# EAGLE schematic raspi (EAGLE 9.2.2)
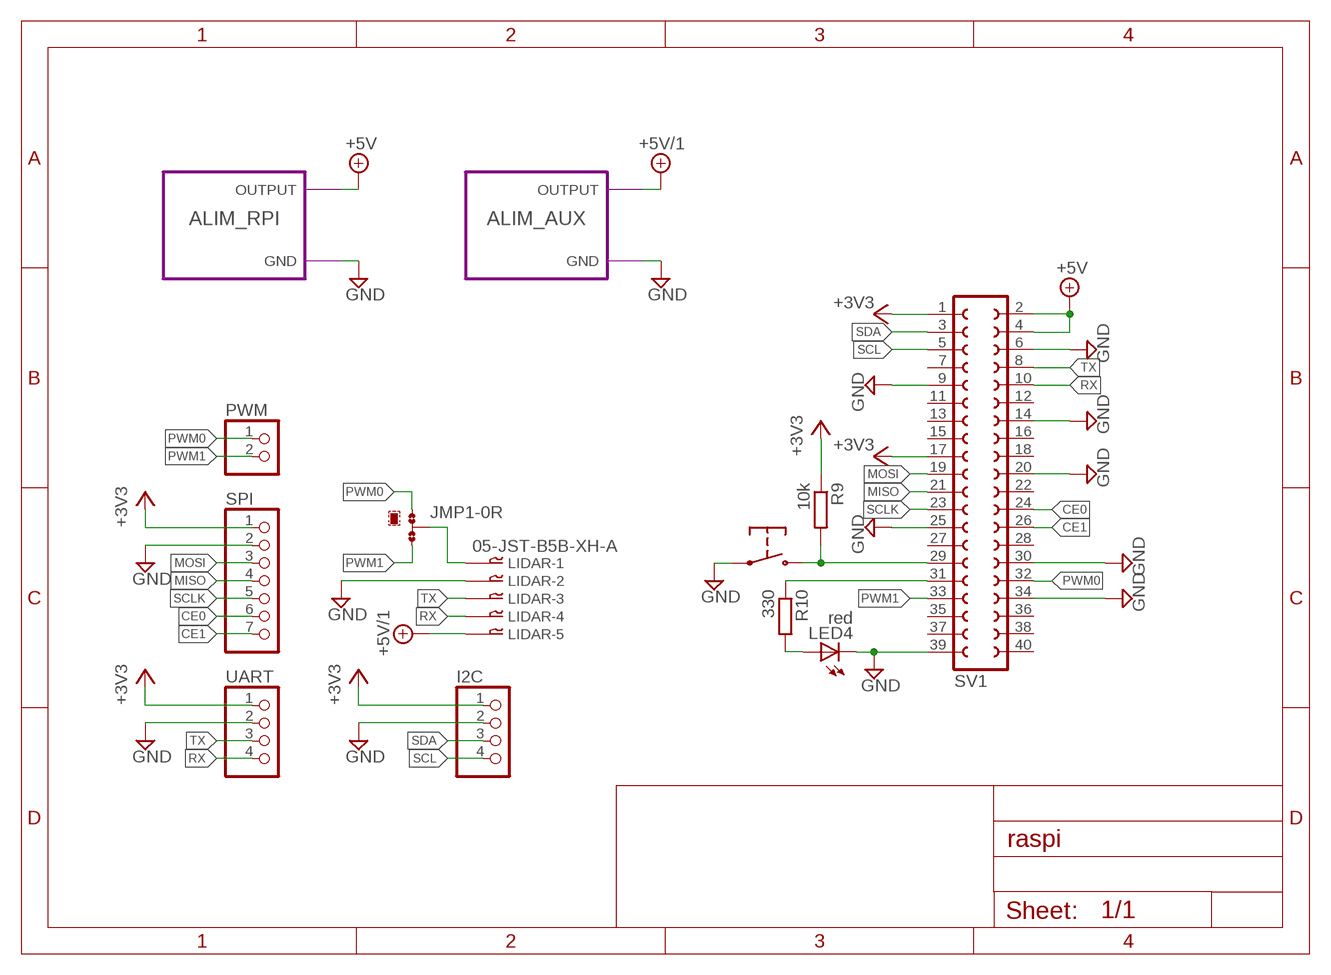
[diagram p0: schematic, sheet 1]

## Parts
I2C  PINHD-1X4  [1X04]
JMP1  0R-JUMPA  [A0R-JMP]
LED4  red  LEDSMT1206  [1206]
LIDAR  05-JST-B5B-XH-A  [B5B-XH]
PWM  PINHD-1X2  [1X02]
R9  10k  R-EU_R0805  [R0805]
R10  330  R-EU_R0805  [R0805]
SPI  PINHD-1X7  [1X07]
SV1  FE20-2  [FE20-2]
U$2  PUSH-BUTTON  [PUSH-BUTTON]
UART  PINHD-1X4  [1X04]

## Module instances
ALIM_RPI = 5V_ALIM
ALIM_AUX = 5V_ALIM

## Nets
+3V3: I2C.1 R9.1 SPI.1 SV1.1 SV1.17 UART.1
+5V [2A]: SV1.2 SV1.4 ; port ALIM_RPI.OUTPUT
+5V/1: LIDAR.P$5 ; port ALIM_AUX.OUTPUT
CE0: SPI.6 SV1.24
CE1: SPI.7 SV1.26
GND: I2C.2 LED4.C LIDAR.P$2 SPI.2 SV1.6 SV1.9 SV1.14 SV1.20 SV1.25 SV1.30 SV1.34 SV1.39 U$2.1 U$2.2 UART.2 ; port ALIM_RPI.GND ALIM_AUX.GND
MISO: SPI.4 SV1.21
MOSI: SPI.3 SV1.19
N$1: JMP1.2 LIDAR.P$1
N$2: R9.2 SV1.29 U$2.3 U$2.4
N$5: R10.1 SV1.31
N$11: LED4.A R10.2
PWM0: JMP1.1 PWM.1 SV1.32
PWM1: JMP1.3 PWM.2 SV1.33
RX: LIDAR.P$4 SV1.10 UART.4
SCL: I2C.4 SV1.5
SCLK: SPI.5 SV1.23
SDA: I2C.3 SV1.3
TX: LIDAR.P$3 SV1.8 UART.3
Unconnected: SV1.7 SV1.11 SV1.12 SV1.13 SV1.15 SV1.16 SV1.18 SV1.22 SV1.27 SV1.28 SV1.35 SV1.36 SV1.37 SV1.38 SV1.40

## Library data of the parts
I2C UART = pinhead:PINHD-1X4: PIN HEADER
JMP1 = jump-0r-smd:0R-JUMP: SMD 0R 0805 Jumper
LED4 = led:LED: LED OSRAM: - CHIPLED LG R971, LG N971, LY N971, LG Q971, LY Q971, LO R971, LY R971 LH N974, LH R974 LS Q976, LO Q976, LY Q976 LO Q996 - Hyper CHIPLED LW Q18S LB Q993, LB Q99A, LB R99A - SideLED LS A670, LO A670, LY A670, LG A670, LP A670 LB A673, LV A673, LT A673, LW A673 LH A674 LY A675 LS A676, LA A676, LO A676, LY A676, LW A676 LS A679, LY A679, LG A679 - Hyper Micro SIDELED® LS Y876, LA Y876, LO Y876, LY Y876 LT Y87S - SmartLED LW L88C, LW L88S LB L89C, LB L89S, LG L890 LS L89K, LO L89K, LY L89K LS L896, LA L896, LO L896, LY L896 - TOPLED LS T670, LO T670, LY T670, LG T670, LP T670 LSG T670, LSP T670, LSY T670, LOP T670, LYG T670 LG T671, LOG T671, LSG T671 LB T673, LV T673, LT T673, LW T673 LH T674 LS T676, LA T676, LO T676, LY T676, LB T676, LH T676, LSB T676, LW T676 LB T67C, LV T67C, LT T67C, LS T67K, LO T67K, LY T67K, LW E67C LS E67B, LA E67B, LO E67B, LY E67B, LB E67C, LV E67C, LT E67C LW T67C LS T679, LY T679, LG T679 LS T770, LO T770, LY T770, LG T770, LP T770 LB T773, LV T773, LT T773, LW T773 LH T774 LS E675, LA E675, LY E675, LS T675 LS T776, LA T776, LO T776, LY T776, LB T776 LHGB T686 LT T68C, LB T68C - Hyper Mini TOPLED® LB M676 - Mini TOPLED Santana® LG M470 LS M47K, LO M47K, LY M47K Source: http://www.osram.convergy.de LUXEON: - LUMILED® LXK2-PW12-R00, LXK2-PW12-S00, LXK2-PW14-U00, LXK2-PW14-V00 LXK2-PM12-R00, LXK2-PM12-S00, LXK2-PM14-U00 LXK2-PE12-Q00, LXK2-PE12-R00, LXK2-PE12-S00, LXK2-PE14-T00, LXK2-PE14-U00 LXK2-PB12-K00, LXK2-PB12-L00, LXK2-PB12-M00, LXK2-PB14-N00, LXK2-PB14-P00, LXK2-PB14-Q00 LXK2-PR12-L00, LXK2-PR12-M00, LXK2-PR14-Q00, LXK2-PR14-R00 LXK2-PD12-Q00, LXK2-PD12-R00, LXK2-PD12-S00 LXK2-PH12-R00, LXK2-PH12-S00 LXK2-PL12-P00, LXK2-PL12-Q00, LXK2-PL12-R00 Source: www.luxeon.com KINGBRIGHT: KA-3528ASYC Source: www.kingbright.com
LIDAR = bt_con-jst-xh:05-JST: JST CONNECTOR
PWM = pinhead:PINHD-1X2: PIN HEADER
R9 R10 = resistor:R-EU_: RESISTOR, European symbol
SPI = pinhead:PINHD-1X7: PIN HEADER
SV1 = con-lsta:FE20-2: FEMALE HEADER; OC_FARNELL: unknown; OC_NEWARK: unknown
U$2 = push-button:PUSH-BUTTON; RS: 479-1491

## Module 5V_ALIM
Ports: OUTPUT(io) GND(io)
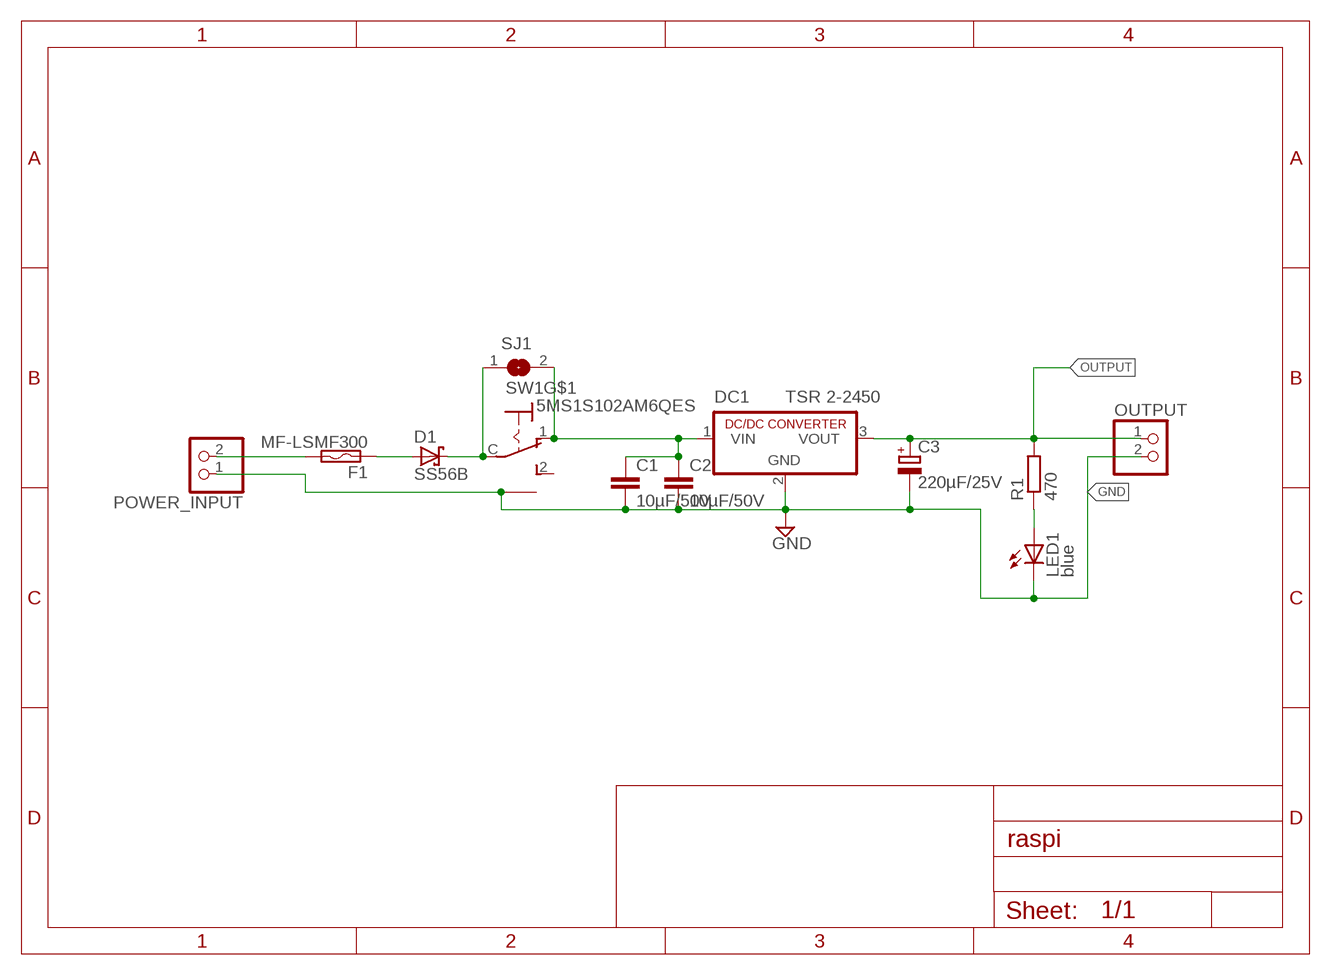
[diagram p1: schematic, module 5V_ALIM, sheet 1]

### Parts
C1  10µF/50V  C-EUC1210  [C1210]
C2  10µF/50V  C-EUC1210  [C1210]
C3  220µF/25V  CPOL-EUE3.5-8  [E3,5-8]
D1  SS56B  SCHOTTKY-DIODESMD  [SMB]
DC1  TSR 2-2450  R-78C5.0-1.0  [SIP3]
F1  MF-LSMF300  [MF-LSMF300]
LED1  blue  LEDSMT1206  [1206]
OUTPUT  PINHD-1X2  [1X02]
POWER_INPUT  PINHD-1X2  [1X02]
R1  470  R-EU_R0805  [R0805]
SJ1  SJ  [SJ]
SW1  5MS1S102AM6QES  [SPDT_SLIDE_SWITCH]

### Nets
GND: C1.2 C2.2 C3.- DC1.2(GND) LED1.C OUTPUT.2 POWER_INPUT.1 SW1.P$4(GND) SW1.P$5(GND)
N$1 [1A]: C1.1 C2.1 DC1.1(VIN) SJ1.2 SW1.1
N$3: LED1.A R1.1
N$4 [1A]: D1.C SJ1.1 SW1.C
N$6: D1.A F1.1
N$7: F1.2 POWER_INPUT.2
OUTPUT [2A]: C3.+ DC1.3(VOUT) OUTPUT.1 R1.2
Unconnected: SW1.2

### Library data of the parts
C1 C2 = resistor:C-EU: CAPACITOR, European symbol
C3 = resistor:CPOL-EU: POLARIZED CAPACITOR, European symbol
D1 = diode:SCHOTTKY-DIODE: Schottky Diode; RS: 917-9221
DC1 = dc-dc-converter:R-78C*-1.0: INNOLINE DC/DC-Converter 1.0 AMP SIP3 Single Output Source: Data sheet <http://www.mikrocontroller.net/attachment/150645/157764-da-01-en-DC_DC_WANDLER_R_78C5_0_1_0.pdf>; RS: 906-8487
F1 = polyswitch:MF-LSMF300: PolySwitch (TM) Resettable Device Source: Data sheet <http://www.farnell.com/datasheets/13482.pdf>; RS: 817-1652
LED1 = led:LED: LED OSRAM: - CHIPLED LG R971, LG N971, LY N971, LG Q971, LY Q971, LO R971, LY R971 LH N974, LH R974 LS Q976, LO Q976, LY Q976 LO Q996 - Hyper CHIPLED LW Q18S LB Q993, LB Q99A, LB R99A - SideLED LS A670, LO A670, LY A670, LG A670, LP A670 LB A673, LV A673, LT A673, LW A673 LH A674 LY A675 LS A676, LA A676, LO A676, LY A676, LW A676 LS A679, LY A679, LG A679 - Hyper Micro SIDELED® LS Y876, LA Y876, LO Y876, LY Y876 LT Y87S - SmartLED LW L88C, LW L88S LB L89C, LB L89S, LG L890 LS L89K, LO L89K, LY L89K LS L896, LA L896, LO L896, LY L896 - TOPLED LS T670, LO T670, LY T670, LG T670, LP T670 LSG T670, LSP T670, LSY T670, LOP T670, LYG T670 LG T671, LOG T671, LSG T671 LB T673, LV T673, LT T673, LW T673 LH T674 LS T676, LA T676, LO T676, LY T676, LB T676, LH T676, LSB T676, LW T676 LB T67C, LV T67C, LT T67C, LS T67K, LO T67K, LY T67K, LW E67C LS E67B, LA E67B, LO E67B, LY E67B, LB E67C, LV E67C, LT E67C LW T67C LS T679, LY T679, LG T679 LS T770, LO T770, LY T770, LG T770, LP T770 LB T773, LV T773, LT T773, LW T773 LH T774 LS E675, LA E675, LY E675, LS T675 LS T776, LA T776, LO T776, LY T776, LB T776 LHGB T686 LT T68C, LB T68C - Hyper Mini TOPLED® LB M676 - Mini TOPLED Santana® LG M470 LS M47K, LO M47K, LY M47K Source: http://www.osram.convergy.de LUXEON: - LUMILED® LXK2-PW12-R00, LXK2-PW12-S00, LXK2-PW14-U00, LXK2-PW14-V00 LXK2-PM12-R00, LXK2-PM12-S00, LXK2-PM14-U00 LXK2-PE12-Q00, LXK2-PE12-R00, LXK2-PE12-S00, LXK2-PE14-T00, LXK2-PE14-U00 LXK2-PB12-K00, LXK2-PB12-L00, LXK2-PB12-M00, LXK2-PB14-N00, LXK2-PB14-P00, LXK2-PB14-Q00 LXK2-PR12-L00, LXK2-PR12-M00, LXK2-PR14-Q00, LXK2-PR14-R00 LXK2-PD12-Q00, LXK2-PD12-R00, LXK2-PD12-S00 LXK2-PH12-R00, LXK2-PH12-S00 LXK2-PL12-P00, LXK2-PL12-Q00, LXK2-PL12-R00 Source: www.luxeon.com KINGBRIGHT: KA-3528ASYC Source: www.kingbright.com
OUTPUT POWER_INPUT = pinhead:PINHD-1X2: PIN HEADER
R1 = resistor:R-EU_: RESISTOR, European symbol
SJ1 = jumper:SJ: SMD solder JUMPER
SW1 = switch:5MS1S102AM6QES; PARTNO: *; REF-FAB: 5MS1S102AM6QES; REF-RS: 734-7296

## Net classes
1 5A: width 2.8 mm, drill 0.5 mm
2 2A: width 0.8 mm, drill 0.4 mm
3 1A: width 0.3 mm, drill 0.35 mm